# EAGLE design SenseTemp - CREAES (EAGLE 9.2.2)
LICENSE: CERN OHL v1.2; REV: CREAES; TITLE: SenseTemp; URL: https://github.com/CapableRobot/SenseTemp

## Sheet 1 of 3
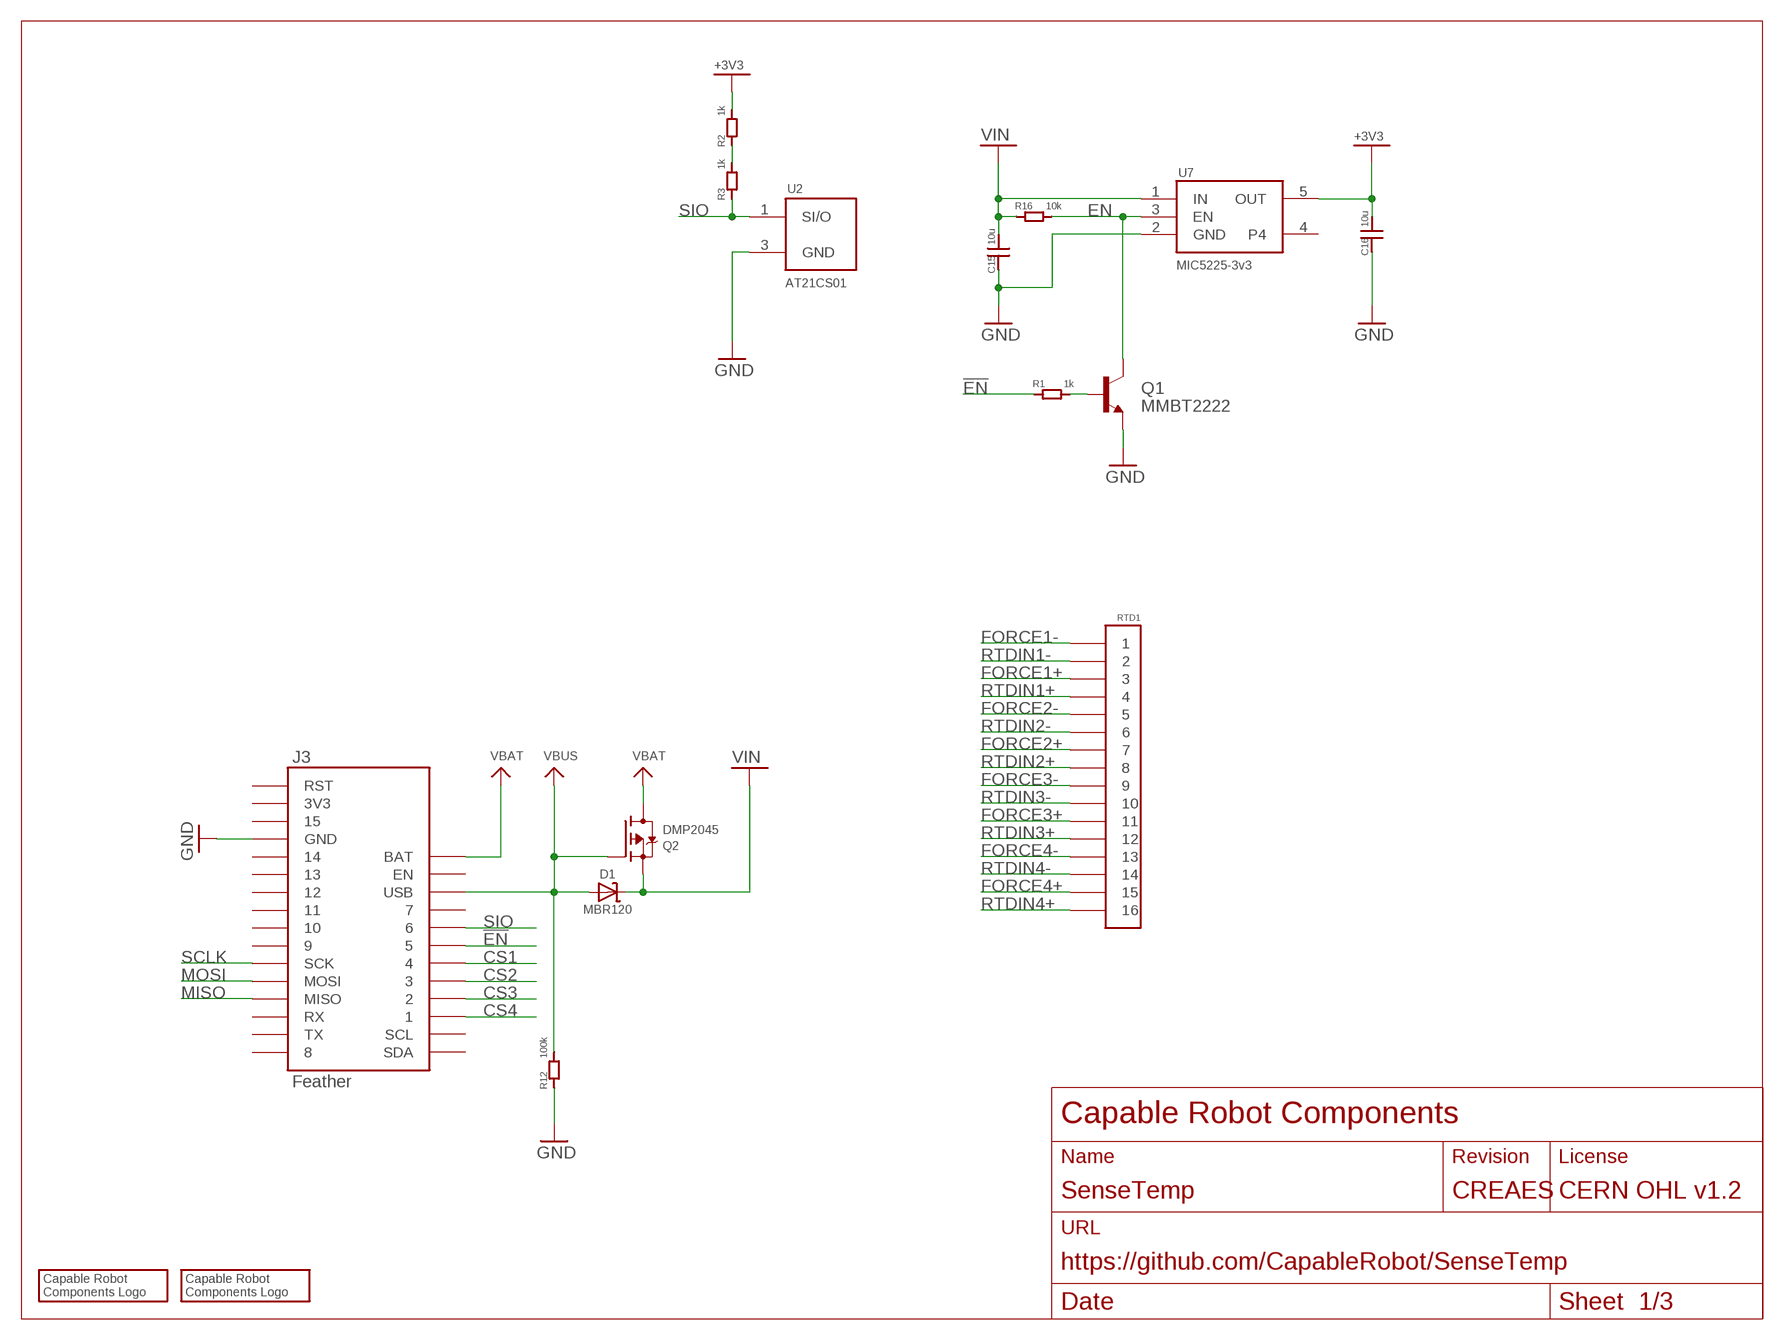
[diagram p0: schematic, sheet 1]

### Parts
C15  10u  CAP0805  [0805]
C16  10u  CAP0805  [0805]
D1  MBR120  DIODE-SCHOTTKYSOD-123  [SOD-123]
J3  FEATHERPTH  [FEATHER-PTH]
LOGO1  CRC-LOGO7SILK  [CRC-LOGO-7-SILK]
LOGO2  CRC-LOGO5  [CRC-LOGO-5]
Q1  MMBT2222  TRANSISTOR_NPNSOT23-3  [SOT23-3]
Q2  DMP2045  MOSFET-P  [SOT23-R]
R1  1k  RES0603  [0603]
R2  1k  RES0603  [0603]
R3  1k  RES0603  [0603]
R12  100k  RES0603  [0603]
R16  10k  RES0603  [0603]
RTD1  CONN-16ZT  [CONN-2X8-050-SMT-ZT]
U2  AT21CS01  [SOT23]
U7  3v3  MIC5225  [SOT25]

### Nets
!EN: J3.5 R1.1
+3V3: C16.2 R2.2 U7.5(OUT) ; also sheet 2,3
CS1: J3.4 ; also sheet 2
CS2: J3.3 ; also sheet 2
CS3: J3.2 ; also sheet 3
CS4: J3.1 ; also sheet 3
EN: Q1.3(C) R16.2 U7.3(EN)
FORCE1+: RTD1.3 ; also sheet 2
FORCE1-: RTD1.1 ; also sheet 2
FORCE2+: RTD1.7 ; also sheet 2
FORCE2-: RTD1.5 ; also sheet 2
FORCE3+: RTD1.11 ; also sheet 3
FORCE3-: RTD1.9 ; also sheet 3
FORCE4+: RTD1.15 ; also sheet 3
FORCE4-: RTD1.13 ; also sheet 3
GND: C15.1 C16.1 J3.GND Q1.2(E) R12.1 U2.3(GND) U7.2(GND) ; also sheet 2,3
MISO: J3.MISO ; also sheet 2,3
MOSI: J3.MOSI ; also sheet 2,3
N$4: R2.1 R3.2
N$17: Q1.1(B) R1.2
RTDIN1+: RTD1.4 ; also sheet 2
RTDIN1-: RTD1.2 ; also sheet 2
RTDIN2+: RTD1.8 ; also sheet 2
RTDIN2-: RTD1.6 ; also sheet 2
RTDIN3+: RTD1.12 ; also sheet 3
RTDIN3-: RTD1.10 ; also sheet 3
RTDIN4+: RTD1.16 ; also sheet 3
RTDIN4-: RTD1.14 ; also sheet 3
SCLK: J3.SCK ; also sheet 2,3
SIO: J3.6 R3.1 U2.1(SI/O)
VBAT: J3.BAT Q2.3(D)
VBUS: D1.A J3.USB Q2.1(G) R12.2
VIN: C15.2 D1.C Q2.2(S) R16.1 U7.1(IN)
Unconnected: J3.3V3 J3.7 J3.8 J3.9 J3.10 J3.11 J3.12 J3.13 J3.14 J3.15 J3.EN J3.RST J3.RX J3.SCL J3.SDA J3.TX U7.4

## Sheet 2 of 3
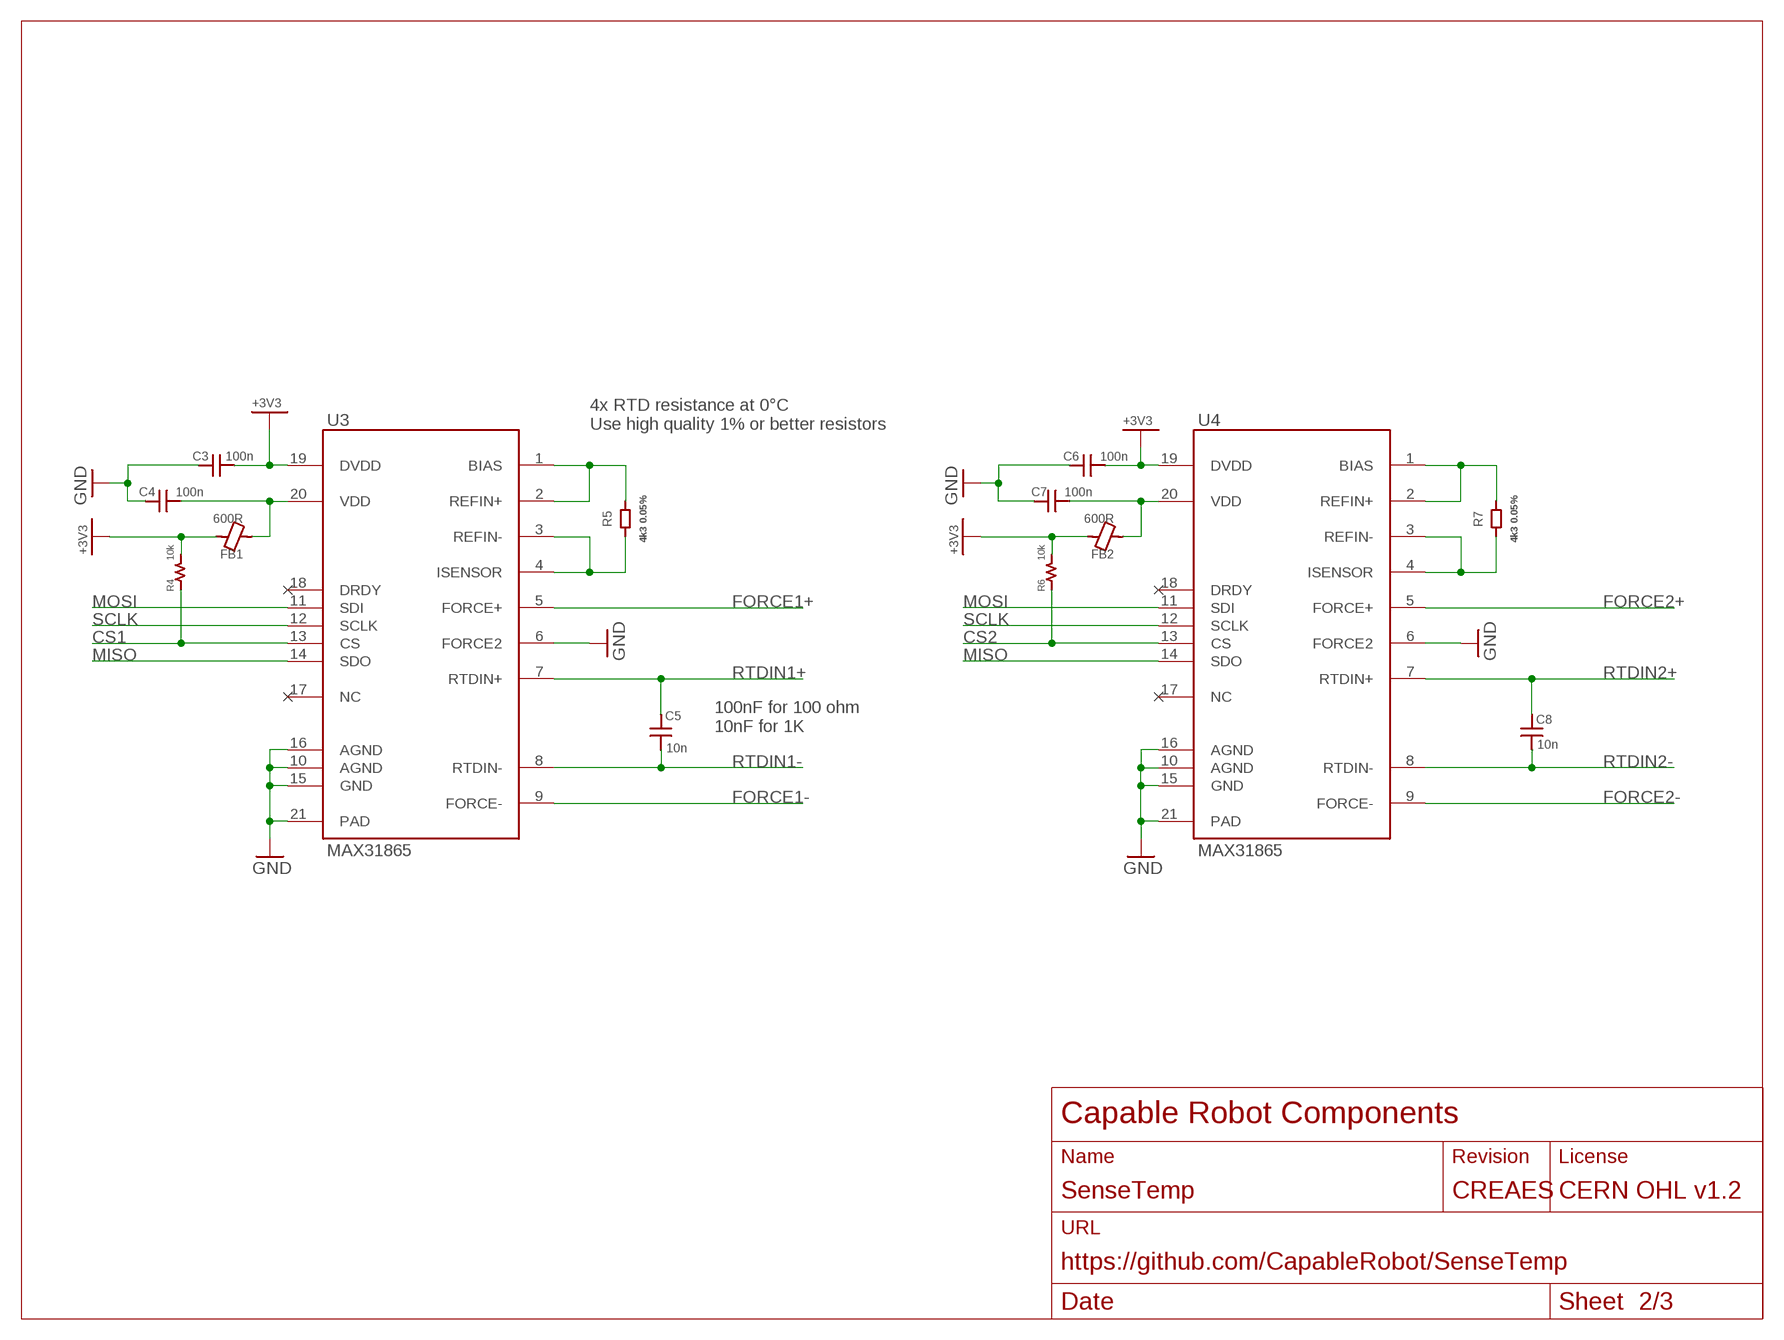
[diagram p1: schematic, sheet 2]

### Parts
C3  100n  CAP0603  [0603]
C4  100n  CAP0603  [0603]
C5  10n  CAP0603  [0603]
C6  100n  CAP0603  [0603]
C7  100n  CAP0603  [0603]
C8  10n  CAP0603  [0603]
FB1  600R  FER0603  [0603]
FB2  600R  FER0603  [0603]
R4  10k  RES0603  [0603]
R5  4k3 0.05%  RES0603  [0603]
R6  10k  RES0603  [0603]
R7  4k3 0.05%  RES0603  [0603]
U3  MAX31865  [QFN65P500X500X100-21T325]
U4  MAX31865  [QFN65P500X500X100-21T325]

### Nets
+3V3: C3.1 C6.1 FB1.2 FB2.2 R4.2 R6.2 U3.19(DVDD) U4.19(DVDD) ; also sheet 1,3
CS1: R4.1 U3.13(CS) ; also sheet 1
CS2: R6.1 U4.13(CS) ; also sheet 1
FORCE1+: U3.5(FORCE+) ; also sheet 1
FORCE1-: U3.9(FORCE-) ; also sheet 1
FORCE2+: U4.5(FORCE+) ; also sheet 1
FORCE2-: U4.9(FORCE-) ; also sheet 1
GND: C3.2 C4.2 C6.2 C7.2 U3.6(FORCE2) U3.10(AGND) U3.15(GND) U3.16(AGND) U3.21(PAD) U4.6(FORCE2) U4.10(AGND) U4.15(GND) U4.16(AGND) U4.21(PAD) ; also sheet 1,3
MISO: U3.14(SDO) U4.14(SDO) ; also sheet 1,3
MOSI: U3.11(SDI) U4.11(SDI) ; also sheet 1,3
N$5: R5.2 U3.1(BIAS) U3.2(REFIN+)
N$6: R5.1 U3.3(REFIN-) U3.4(ISENSOR)
N$7: C4.1 FB1.1 U3.20(VDD)
N$8: R7.2 U4.1(BIAS) U4.2(REFIN+)
N$9: R7.1 U4.3(REFIN-) U4.4(ISENSOR)
N$10: C7.1 FB2.1 U4.20(VDD)
RTDIN1+: C5.1 U3.7(RTDIN+) ; also sheet 1
RTDIN1-: C5.2 U3.8(RTDIN-) ; also sheet 1
RTDIN2+: C8.1 U4.7(RTDIN+) ; also sheet 1
RTDIN2-: C8.2 U4.8(RTDIN-) ; also sheet 1
SCLK: U3.12(SCLK) U4.12(SCLK) ; also sheet 1,3
Unconnected: U3.17(NC) U3.18(DRDY) U4.17(NC) U4.18(DRDY)

### Notes on the sheet
- 4x RTD resistance at 0°C 
  Use high quality 1% or better resistors
- 100nF for 100 ohm
  10nF for 1K

## Sheet 3 of 3
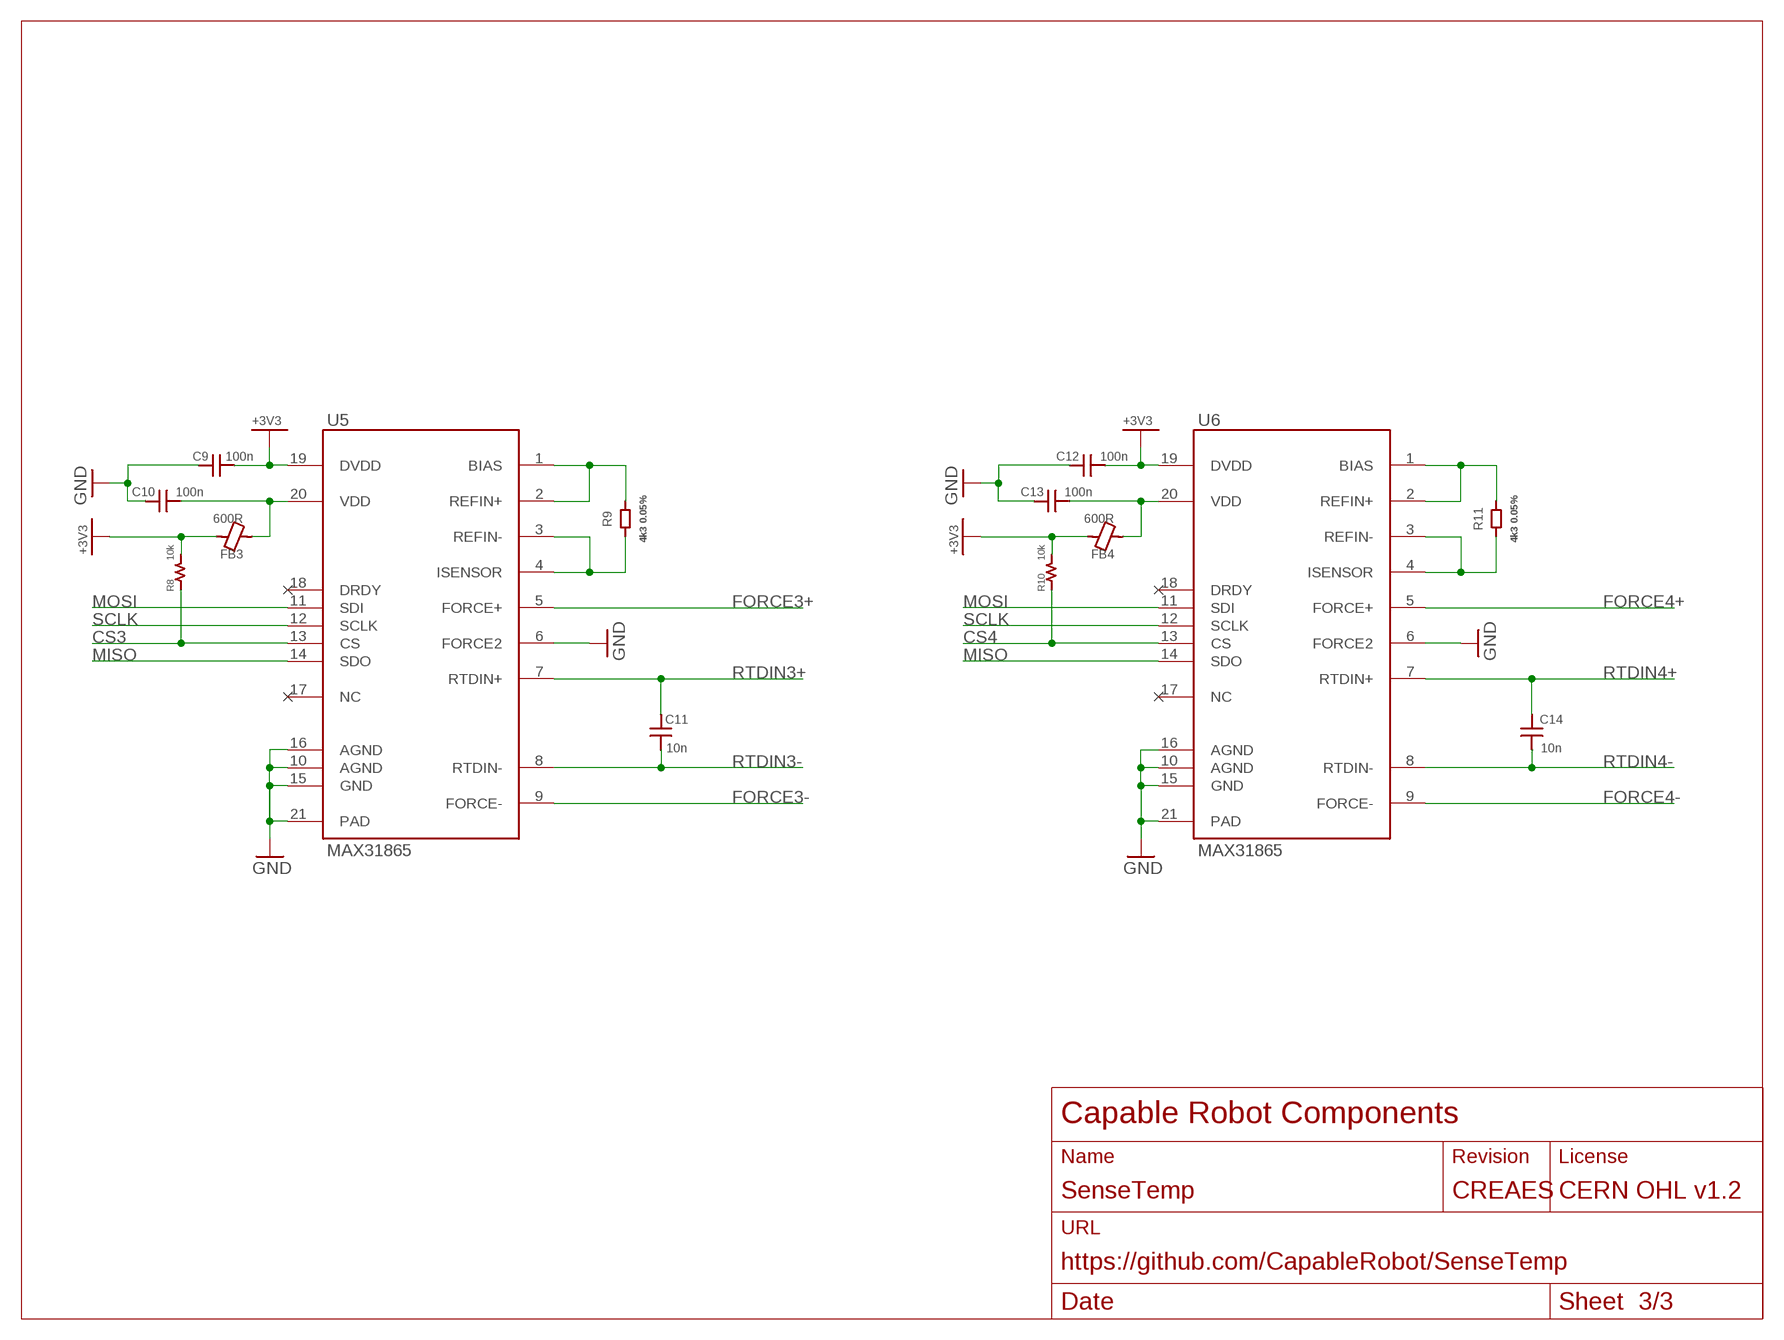
[diagram p2: schematic, sheet 3]

### Parts
C9  100n  CAP0603  [0603]
C10  100n  CAP0603  [0603]
C11  10n  CAP0603  [0603]
C12  100n  CAP0603  [0603]
C13  100n  CAP0603  [0603]
C14  10n  CAP0603  [0603]
FB3  600R  FER0603  [0603]
FB4  600R  FER0603  [0603]
R8  10k  RES0603  [0603]
R9  4k3 0.05%  RES0603  [0603]
R10  10k  RES0603  [0603]
R11  4k3 0.05%  RES0603  [0603]
U5  MAX31865  [QFN65P500X500X100-21T325]
U6  MAX31865  [QFN65P500X500X100-21T325]

### Nets
+3V3: C9.1 C12.1 FB3.2 FB4.2 R8.2 R10.2 U5.19(DVDD) U6.19(DVDD) ; also sheet 1,2
CS3: R8.1 U5.13(CS) ; also sheet 1
CS4: R10.1 U6.13(CS) ; also sheet 1
FORCE3+: U5.5(FORCE+) ; also sheet 1
FORCE3-: U5.9(FORCE-) ; also sheet 1
FORCE4+: U6.5(FORCE+) ; also sheet 1
FORCE4-: U6.9(FORCE-) ; also sheet 1
GND: C9.2 C10.2 C12.2 C13.2 U5.6(FORCE2) U5.10(AGND) U5.15(GND) U5.16(AGND) U5.21(PAD) U6.6(FORCE2) U6.10(AGND) U6.15(GND) U6.16(AGND) U6.21(PAD) ; also sheet 1,2
MISO: U5.14(SDO) U6.14(SDO) ; also sheet 1,2
MOSI: U5.11(SDI) U6.11(SDI) ; also sheet 1,2
N$11: R9.2 U5.1(BIAS) U5.2(REFIN+)
N$12: R9.1 U5.3(REFIN-) U5.4(ISENSOR)
N$13: C10.1 FB3.1 U5.20(VDD)
N$14: R11.2 U6.1(BIAS) U6.2(REFIN+)
N$15: R11.1 U6.3(REFIN-) U6.4(ISENSOR)
N$16: C13.1 FB4.1 U6.20(VDD)
RTDIN3+: C11.1 U5.7(RTDIN+) ; also sheet 1
RTDIN3-: C11.2 U5.8(RTDIN-) ; also sheet 1
RTDIN4+: C14.1 U6.7(RTDIN+) ; also sheet 1
RTDIN4-: C14.2 U6.8(RTDIN-) ; also sheet 1
SCLK: U5.12(SCLK) U6.12(SCLK) ; also sheet 1,2
Unconnected: U5.17(NC) U5.18(DRDY) U6.17(NC) U6.18(DRDY)

## Library data of the parts
C3-C16 = CapableRobot:CAP
D1 = Adafruit Feather M0 Express:DIODE-SCHOTTKY; MPN: MBR120VLSFT3G
FB1-FB4 = CapableRobot:FER: Ferrite
J3 = CapableRobot:FEATHER
LOGO1 LOGO2 = CapableRobot:CRC-LOGO
Q1 = Adafruit HUZZAH32 ESP32 Feather:TRANSISTOR_NPN: Transistor NPN BJT configuration in SOT23 package. MMBT2222 is the common NPN we use. Double check BCE configuration again layout.; MPN: MMBT2222LT1G
Q2 = Adafruit Feather M4 Express:MOSFET-P: P-Channel Mosfet LEGEND VDS: Voltage Drain-Source ID: Drain Current RDS(ON): Drain-Source On-State Resistance VGS(TH): Gate-Source Threshold Voltage CISS: Drain-Source Input Capacitance SOT-23 Name VDS ID RDS(ON) VGS(TH) CISS Order Number IRLML5103 30V 760mA 600 mOhm -- 75pF @ 25V Digikey: IRLML5103PBFCT-ND IRLML6401 12V 4.3A 50 mOhm 950mV @ 250µA 830pF @ 10V Digikey: IRLML6401PBFTR-ND NTR0202PL 20V 400mA 800 mOhm 2.3V @ 250uA 70pF @ 5V Digikey: NTR0202PLT1GOSTR-ND NTR4101PT1G 20V 1.8A 85 mOhm 1.2V @ 250uA 675pF @ 10V Digikey: NTR4101PT1GOSCT-ND DMP2004K 20V 600mA 900 mOhm 1V @ 250uA 175pF @ 16V Digikey: DMP2004KDICT-ND PMV65XP 20V 3.9A 76 mOhm 950mV @ 1mA 725pF @ 20V Digikey: 568-2358-2-ND TO-252 Name VDS ID RDS(ON) VGS(TH) CISS Order Number AOD417 30V 25A 34 mOhm 3V @ 250µA 920pF @ 15V Digikey: 785-1106-2-ND PowerPak Name VDS ID RDS(ON) VGS(TH) CISS Order Number AON7401 30V 12A 14 mOhm 3V @ 250µA 2600pF @ 15V Digikey: 785-1302-1-ND; MPN: DMP2045U-7
R1-R12 R16 = CapableRobot:RES
RTD1 = CapableRobot:CONN-16; MPN: 3221-16-0300-00
U2 = CapableRobot:AT21CS01: Single-Wire, I/O Powered 1-Kbit (128 x 8) Serial EEPROM with a Unique, Factory-Programmed 64-Bit Serial Number
U3-U6 = CapableRobot:MAX31865: RTD-to-Digital Converter
U7 = CapableRobot:MIC5225: Ultra-Low Quiescent Current 150mA Low Dropout Regulator

## Board
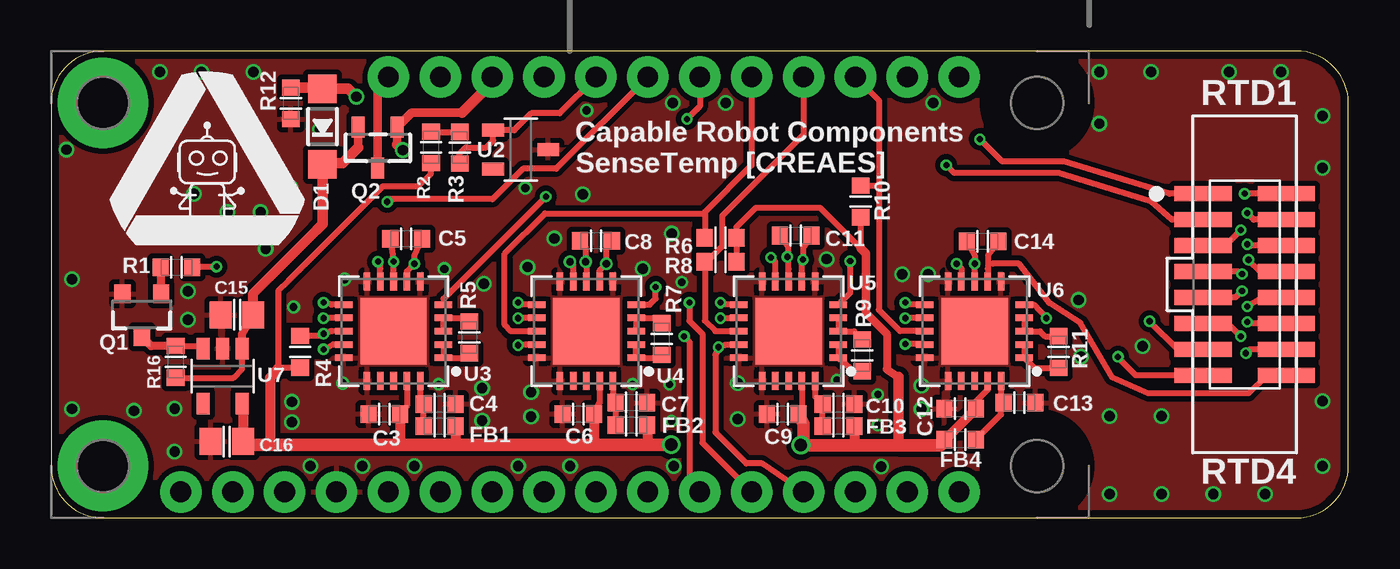
[diagram p3: board, top side]
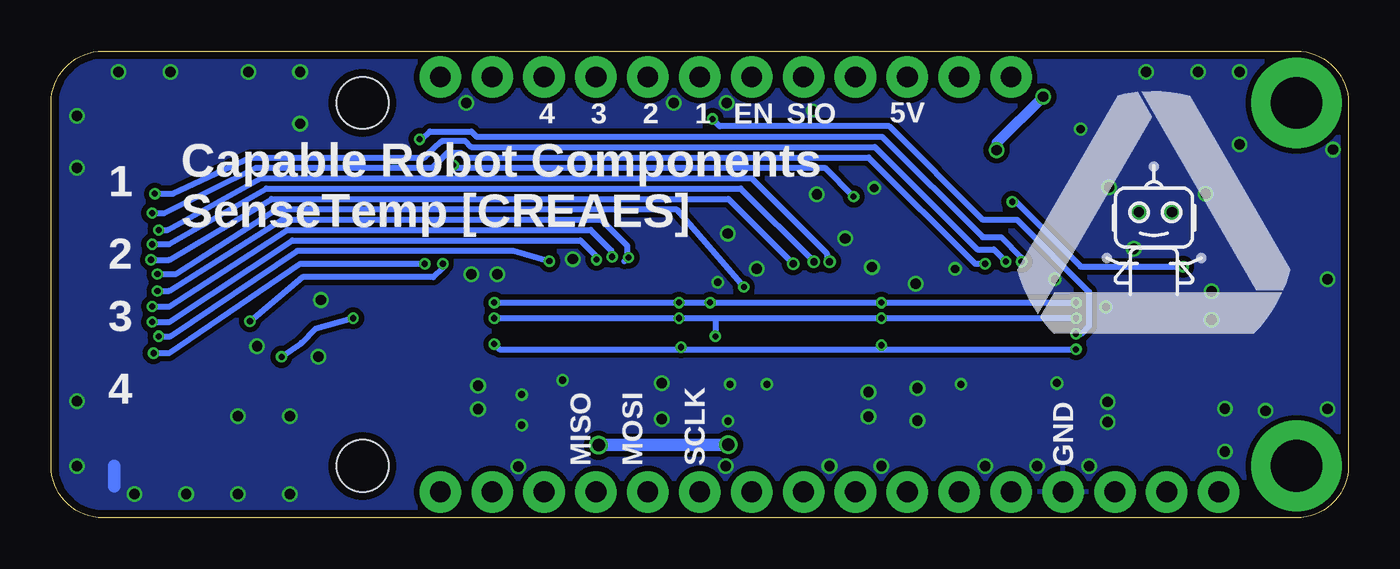
[diagram p4: board, bottom side, seen from below]

Size 63.5 x 22.86 mm. Coordinates in mm from the lower left corner, seen from the top.
Outline: 0,20.32 0,2.54 arc90 2.54,0 60.96,0 arc90 63.5,2.54 63.5,20.32 arc90 60.96,22.86 2.54,22.86 arc90 0,20.32
Copper layers (1*16): Top 0.035559375mm / dielectric 1.6mm / Bottom 0.035559375mm
Design rules "oshpark-2layer-tented *": minimum track width 6mil, minimum drill 10mil, track to track 6mil, track to pad 6mil, pad to pad 6mil, via to via 6mil, smd to smd 6mil, copper to edge 15mil, drill to drill 6mil, minimum pad ring 5mil, minimum via ring 5mil, stop-mask expansion 2.5mil, vias tented up to drill 25mil, thermal gap 10mil
Holes 2.54 mm at 48.26,2.54 48.26,20.32
tRestrict: area 45.7,17.8 to 50.8,22.9; area 45.7,0 to 50.8,5.1

### Footprints (pad centres in the part's own frame; a part is rotated, then mirrored left to right if it is on the bottom)
0603 = smd 0.79 x 0.86: 1 -0.775,0; 2 0.775,0
0805 = smd 1.079 x 1.321: 1 -0.794,0; 2 0.794,0
SOD-123 = smd 1.4 x 1.4: A 1.85,0; C -1.85,0
FEATHER-PTH = drill 1.016 pad 2.032: 1 39.37,21.59; 2 36.83,21.59; 3 34.29,21.59; 3V3 8.89,1.27; 4 31.75,21.59; 5 29.21,21.59; 6 26.67,21.59; 7 24.13,21.59; 8 44.45,1.27; 9 29.21,1.27; 10 26.67,1.27; 11 24.13,1.27; 12 21.59,1.27; 13 19.05,1.27; 14 16.51,1.27; 15 11.43,1.27; BAT 16.51,21.59; EN 19.05,21.59; GND 13.97,1.27; MISO 36.83,1.27; MOSI 34.29,1.27; RST 6.35,1.27; RX 39.37,1.27; SCK 31.75,1.27; SCL 41.91,21.59; SDA 44.45,21.59; TX 41.91,1.27; USB 21.59,21.59
SOT23-3 = smd 0.8 x 0.9: 1 -0.95,-1; 2 0.95,-1; 3 0,1.1
SOT23-R = smd 0.635 x 1.016: 1 -0.95,-1; 2 0.95,-1; 3 0,1
CONN-2X8-050-SMT-ZT = smd 0.737 x 2.794: 1 4.445,2.032; 2 4.445,-2.032; 3 3.175,2.032; 4 3.175,-2.032; 5 1.905,2.032; 6 1.905,-2.032; 7 0.635,2.032; 8 0.635,-2.032; 9 -0.635,2.032; 10 -0.635,-2.032; 11 -1.905,2.032; 12 -1.905,-2.032; 13 -3.175,2.032; 14 -3.175,-2.032; 15 -4.445,2.032; 16 -4.445,-2.032
SOT23 = smd 0.635 x 1.067: 1 0.95,1.346; 2 -0.95,1.346; 3 0,-1.346
QFN65P500X500X100-21T325 = smd 0.86 x 0.32: 1 -2.435,1.3; 2 -2.435,0.65; 3 -2.435,0; 4 -2.435,-0.65; 5 -2.435,-1.3; 11 2.435,-1.3; 12 2.435,-0.65; 13 2.435,0; 14 2.435,0.65; 15 2.435,1.3 | smd 0.32 x 0.86: 6 -1.3,-2.435; 7 -0.65,-2.435; 8 0,-2.435; 9 0.65,-2.435; 10 1.3,-2.435; 16 1.3,2.435; 17 0.65,2.435; 18 0,2.435; 19 -0.65,2.435; 20 -1.3,2.435 | smd 3.25 x 3.25: 21 0,0
SOT25 = smd 0.635 x 1.067: 1 -0.95,-1.346; 2 0,-1.346; 3 0.95,-1.346; 4 0.95,1.346; 5 -0.95,1.346

### Placement (x,y rotation side)
C3  16.31,5.08 180 top
C4  19.02,5.57 0 top
C5  17.38,13.67 180 top
C6  25.81,5.08 180 top
C7  28.4,5.64 0 top
C8  26.67,13.57 180 top
C9  35.81,5.08 180 top
C10  38.54,5.57 0 top
C11  36.45,13.82 180 top
C12  44.5,5.34 180 top
C13  47.4,5.64 0 top
C14  45.59,13.54 180 top
C15  9.1,9.94 0 top
C16  8.6,3.74 0 top
D1  13.29,19.16 90 top
FB1  19.02,4.5 0 top
FB2  28.4,4.54 0 top
FB3  38.54,4.5 0 top
FB4  44.5,3.84 180 top
J3  0,0 0 top
LOGO1  9.52,13.96 0 bottom
LOGO2  7.65,16.89 0 top
Q1  4.44,9.97 180 top
Q2  15.99,18.13 180 top
R1  6.14,12.28 180 top
R2  18.6,18.14 270 top
R3  20,18.12 90 top
R4  12.19,8.13 270 top
R5  20.47,8.84 270 top
R6  32.77,13.72 0 top
R7  29.9,8.76 270 top
R8  32.77,12.54 0 top
R9  39.7,7.96 270 top
R10  39.62,15.49 270 top
R11  49.32,8.12 270 top
R12  11.74,20.3 90 top
R16  6.1,7.64 90 top
RTD1  58.42,11.43 90 top
U2  22.99,18.03 90 top
U3  16.77,9.14 180 top
U4  26.2,9.14 180 top
U5  36.1,9.14 180 top
U6  45.2,9.14 180 top
U7  8.4,6.94 180 top

### Tracks (layer width: path | path; a pad name or v marks a point on that pad's centre or on a via)
!EN  (via drill 0.3)
  Top 0.3: J3.5 24.72,17.1 23.1,17.1 21.6,15.6 16.57,15.6 v16.45,15.48 | v8.1,12.3 8.08,12.28 R1.1
  Bottom 0.3: v16.45,15.48 16.28,15.48 13.1,12.3 v8.1,12.3
+3V3  (via drill 0.61)
  Top 0.3: U3.19 17.41,5.49 C3.1 | U4.19 26.85,5.65 C6.1 | U5.19 36.75,5.16 C9.1 | 15.94,15.94 16.24,16.24 18,16.24 18.6,16.84 R2.2 | 11.61,11.61 11.12,11.12 11.12,7.35 | U6.19 45.85,6.29 45.27,5.71 45.27,5.29 | 26.58,3.6 26.6,3.58 | 34.5,15.19 37.64,15.19 38.61,14.22
  Top 0.305: C6.1 26.81,5.13 | C3.1 17.11,5.13 | 12.05,7.21 R4.2 11.12,7.35 | R6.2 33.49,13.77 | 38.61,14.22 39.62,13.21 R10.2 | 36.72,5.13 C9.1 36.57,5.07 | R6.2 R8.2 | R6.2 33.54,14.21 33.53,14.22 34.5,15.19 | 15.94,15.94 11.61,11.61
  Top 0.4: 41.48,6.9 40.9,7.28 40.9,9.01 39.88,10.03
  Top 0.406: 39.88,10.03 39.88,12.95 39.62,13.21
  Top 0.5: 11.12,7.35 10.72,6.85 10.72,3.58 | U7.5 9.39,5.55 C16.2 9.45,3.68 | 43.54,3.56 43.54,3.65 FB4.2 43.76,3.82 C12.1 45.27,5.29 | FB3.2 39.32,3.54 40.4,3.56 | C6.1 26.58,3.6 | FB2.2 29.2,4.51 29.2,3.58 | FB1.2 19.79,3.59 19.8,3.58 | C3.1 17.09,3.6 17.1,3.58
  Top 0.508: 41.48,6.9 41.48,3.56
  Top 0.6: 9.4,3.58 9.45,3.68
  Top 0.61: v30.35,3.58 29.2,3.58 26.6,3.58 19.8,3.58 17.1,3.58 10.72,3.58 9.4,3.58 | 36.84,3.56 v36.7,3.56 36.76,3.62 | 36.84,3.56 40.4,3.56 41.48,3.56 43.54,3.56 | C9.1 36.84,4.61 36.84,3.56
  Bottom 0.61: v30.35,3.58 36.58,3.58 v36.7,3.56
CS1  (via drill 0.3)
  Top 0.3: U3.13 14.27,9.14 13.76,9.14
  Top 0.305: 13.76,9.14 v13.34,9.02 13.22,8.9 R4.1 | v31.13,19.53 31.75,20.16 J3.4
  Bottom 0.305: v13.34,9.02 13.08,9.02 12.7,9.4 12.7,11.07 16.21,14.59 17.89,14.59 22.48,19.18 30.77,19.18 v31.13,19.53
CS2
  Top 0.3: U4.13 22.5,9.14 22.2,9.44 22.2,12.94 24.17,14.91 31.93,14.91 32,14.99
  Top 0.305: 31.99,13.96 R6.1 32,13.73 32,14.99 34.29,17.27 J3.3
CS3
  Top 0.3: 32.51,9.14 U5.13
  Top 0.305: 32.51,9.14 32,9.65 32,12.45 | 32,12.45 32,12.55 R8.1 | J3.2 36.83,18.77 32.84,14.78 32.84,13.28 32,12.45
CS4
  Top 0.3: U6.13 41.56,9.14
  Top 0.305: 40.51,16.26 40.51,10.19 41.56,9.14 | R10.1 39.64,16.26 40.51,16.26 | J3.1 40.51,20.45 40.51,16.26
EN
  Top 0.3: R16.2 7.32,8.41 U7.3
  Top 0.4: R16.2 4.89,8.41 Q1.3
FORCE1+  (via drill 0.3)
  Top 0.3: 19.2,10.72 U3.5
  Top 0.305: v24.22,15.74 19.2,10.72 | v43.81,17.27 44.2,16.89 49.34,16.89 53.85,15.49 54.86,14.61 RTD1.3
  Bottom 0.305: v24.22,15.74 25.63,17.14 43.69,17.14 v43.81,17.27
FORCE1-  (via drill 0.3)
  Top 0.3: U3.9 16.11,12.21 16.11,12.41
  Top 0.305: 16.11,12.41 v16,12.55 | RTD1.1 54.74,15.88 49.59,17.45 46.56,17.45 v45.47,18.54
  Bottom 0.305: v16,12.55 16,12.75 17,13.74 17.9,13.74 22.82,18.67 42.67,18.67 42.93,18.92 44.96,18.92 45.34,18.54 v45.47,18.54
FORCE2+  (via drill 0.3)
  Top 0.3: U4.5 29.3,10.44 29.59,10.73 v29.59,11.3
  Top 0.305: v58.29,11.94 58.1,12.06 RTD1.7
  Bottom 0.305: v29.59,11.3 32.89,15.11 52.45,15.11 57.4,11.94 v58.29,11.94
FORCE2-  (via drill 0.3, 0.36)
  Top 0.3: v25.4,12.55 25.55,12.4 U4.9
  Top 0.305: 25.51,12.43 v25.4,12.55 | RTD1.5 57.47,13.34 v58.23,14.1
  Bottom 0.305: v25.4,12.55 25.53,12.67 25.53,12.95 29.21,16.64 53.21,16.64 57.78,14.1 v58.23,14.1
FORCE3+  (via drill 0.3)
  Top 0.3: U5.5 39.12,11.02 v39.12,12.57
  Top 0.305: v58.23,8.89 57.59,9.53 RTD1.11
  Bottom 0.305: v39.12,12.57 40.89,13.08 51.44,13.08 57.66,8.89 v58.23,8.89
FORCE3-  (via drill 0.3)
  Top 0.3: U5.9 35.45,12.53 v35.23,12.75
  Top 0.305: v58.29,11.11 57.98,10.79 RTD1.9
  Bottom 0.305: v35.23,12.75 35.43,12.57 35.31,12.7 35.31,13.34 36.58,14.61 52.2,14.61 57.72,11.11 v58.29,11.11
FORCE4+  (via drill 0.3)
  Top 0.305: v48.71,9.78 48.1,10.44 U6.5 | RTD1.15 53.09,6.99 52.22,7.85 v52.22,7.88
  Bottom 0.305: v48.71,9.78 50.55,9.27 51.24,8.57 52.23,7.89 v52.22,7.88
FORCE4-  (via drill 0.3)
  Top 0.3: 44.56,12.21 44.55,12.2 U6.9
  Top 0.305: v44.32,12.45 44.56,12.21 | v53.77,9.63 55.14,8.26 RTD1.13
  Bottom 0.305: v44.32,12.45 44.32,12.25 44.78,11.78 51.18,11.78 v53.77,9.63
GND  (via drill 0.35, 0.38, 0.4, 0.51)
  Top 0.305: C6.2 24.86,5.18 | C12.2 43.91,5.18
  Bottom 0.6: 60.4,2.54 60.4,1.54
  other vias: 10.26,14.98 8.64,14.98 10.5,13.18 6.7,11.1 4.05,5.24 11.79,5.68 14.27,6.6 12.7,2.54 15.24,2.54 17.78,2.54 22.86,2.54 25.4,2.54 33.6,6.6 41.66,11.94 42.93,11.94 43.18,20.32 57.66,21.84 7.37,21.84 5.33,18.29 0.76,18.03 1.02,11.68 1.02,5.33 23.5,4.95 30.48,2.54 33.6,4.83 42.6,5.33 37.97,12.67 30.38,13.92 28.96,12.19 26.02,15.85 23.21,16.16 19.25,12.19 21.19,11.46 14.37,11.68 23.32,12.28 11.71,16.18 5.33,21.84 33.02,20.32 11.86,10.33 6.99,15.88 53.42,8.4 50.29,10.67 40.47,4.54 42.6,6.48 38.47,6.74 30.37,4.74 28.47,6.54 30.27,6.54 23.5,6.15 21.09,4.75 21.09,6.35 18.97,6.54 24.62,13.68 40.47,6.04 30.87,11.54 50.42,7.9 6.7,9.7 6.05,3.24 6.05,5.34 11.79,4.68 30.42,20.32 40.63,2.52 62.23,5.71 51.81,1.16 13.11,19.03 26.21,19.96 51.31,21.84 53.85,21.84 51.31,19.3 54.35,1.16 56.89,1.16 59.43,1.16 62.23,2.54 51.81,4.97 54.35,4.97 62.23,19.68 62.23,17.14 60.2,21.84 9.91,21.84
  pour Bottom (isolate 0.254, rank 6): 0,0 63.5,0 63.5,25.4 0,25.4
  pour Top (isolate 0.254): 0,22.86 0,0 12.7,0 48,0.14 48.19,0 63.5,0 63.5,22.86
MISO  (via drill 0.3)
  Top 0.3: U3.14 13.83,8.49 | U4.14 23.23,8.49 | v32.67,8.36 33,8.49 U5.14 | U6.14 42.75,8.51 v41.81,8.51
  Top 0.305: 13.83,8.49 v13.34,8.26 | J3.MISO 34.8,2.67 34.04,2.67 32.51,4.19 32.51,8 v32.67,8.36 | 23.23,8.49 v22.86,8.46
  Bottom 0.305: v41.81,8.51 41.56,8.26 32.8,8.24 v32.67,8.36 32.5,8.24 22.9,8.24 | 22.8,8.24 22.9,8.24 | 22.9,8.24 v22.86,8.46 22.8,8.24 | 22.8,8.24 v13.34,8.26
MOSI  (via drill 0.3)
  Top 0.3: U3.11 13.74,10.44 13.73,10.44 | U4.11 22.96,10.44 | U5.11 32.87,10.44 v32.77,10.54 | U6.11 41.91,10.44 v41.81,10.54
  Top 0.305: 13.73,10.44 v13.34,10.54 | 22.96,10.44 v22.86,10.54 | J3.MOSI 31.88,3.68 31.88,9.02 31.24,9.65 v31.24,10.54
  Bottom 0.305: v41.81,10.54 v32.77,10.54 v31.24,10.54 v22.86,10.54 v13.34,10.54
N$1  (via drill 2.54 pad 4.45)
  other vias: 2.54,2.54
N$2  (via drill 2.54 pad 4.45)
  other vias: 2.54,20.32
N$4
  Top 0.3: R2.1 18.61,18.9 R3.2
N$5
  Top 0.3: U3.2 U3.1 20.35,7.84 R5.2
  Top 0.305: 20.67,7.84 R5.2
N$6
  Top 0.3: U3.3 U3.4 20.2,9.79 R5.1
N$7
  Top 0.3: U3.20 18.07,5.75 C4.1 FB1.1
N$8
  Top 0.3: U4.1 U4.2 | 28.74,7.84 U4.1 | U4.1 29.76,7.84 R7.2
N$9
  Top 0.3: U4.3 U4.4 29.64,9.79 R7.1
N$10
  Top 0.3: U4.20 27.5,5.97 C7.1 FB2.1
N$11
  Top 0.3: U5.2 U5.1 39.29,7.18 R9.2
N$12
  Top 0.3: U5.4 U5.3 39.3,9.14 R9.1
N$13
  Top 0.3: FB3.1 C10.1 37.4,5.94 U5.20
N$14
  Top 0.3: U6.2 U6.1 48.13,7.34 R11.2
N$15
  Top 0.3: U6.4 U6.3 | U6.3 | U6.3 48.4,9.14 48.65,8.89 R11.1
N$16
  Top 0.3: U6.20 46.5,5.51 | 46.5,5.51 C13.1 | FB4.1 46.5,5.07 46.5,5.51
N$17
  Top 0.4: Q1.1 5.39,12.26 R1.2
RTDIN1+  (via drill 0.3)
  Top 0.3: U3.7 17.41,12.08
  Top 0.305: 17.41,12.08 v17.78,12.45 17.78,12.83 C5.1 | v58.55,14.92 58.86,14.61 RTD1.4
  Bottom 0.305: v17.78,12.45 18.28,12.45 23.49,17.65 43.21,17.65 43.44,17.88 44.09,17.88 44.83,17.14 53.47,17.14 57.98,14.92 v58.55,14.92
RTDIN1-  (via drill 0.3)
  Top 0.3: U3.8 v16.77,12.54 v16.76,12.55
  Top 0.305: C5.2 v16.76,12.55 | RTD1.2 v58.42,15.88
  Bottom 0.305: v16.76,12.55 17.36,13.15 18.16,13.15 23.18,18.16 42.94,18.16 43.25,18.47 44.35,18.47 44.4,18.41 45.09,17.78 45.21,17.65 53.72,17.65 57.53,15.88 v58.42,15.88
RTDIN2+  (via drill 0.3, 0.36)
  Top 0.3: U4.7 26.85,12.12 v27.18,12.45 27.18,13.46 C8.1
  Top 0.305: v58.61,12.64 59.18,12.06 RTD1.8
  Bottom 0.305: v27.18,12.45 30.35,15.62 52.7,15.62 57.72,12.64 v58.61,12.64
RTDIN2-  (via drill 0.3, 0.36)
  Top 0.3: v26.16,12.55 26.2,12.51 U4.8
  Top 0.305: C8.2 25.65,13.57 26.16,13.26 v26.16,12.55 | v58.55,13.4 58.74,13.34 RTD1.6
  Bottom 0.305: v26.16,12.55 29.75,16.13 52.96,16.13 57.72,13.4 v58.55,13.4
RTDIN3+  (via drill 0.3)
  Top 0.3: U5.7 36.75,12.59 v36.8,12.65 36.8,13.22
  Top 0.305: C11.1 36.8,13.22 | RTD1.12 58.67,9.53 v58.55,9.59
  Bottom 0.305: v36.8,12.65 36.8,12.8 37.59,13.59 51.69,13.59 57.72,9.59 v58.55,9.59
RTDIN3-  (via drill 0.3)
  Top 0.3: 36.07,12.75 v36.04,12.79 | U5.8 36.1,12.19 36.1,12.7 36.1,12.72 36.07,12.75 | 36.07,13.26 36.07,12.75
  Top 0.305: C11.2 36.07,13.26 | v58.55,10.35 59.31,10.79 RTD1.10
  Bottom 0.305: v36.04,12.79 36.09,13.1 37.08,14.1 51.94,14.1 57.72,10.35 v58.55,10.35
RTDIN4+
  Top 0.3: 45.86,12.41 45.85,12.2 U6.7
  Top 0.305: C14.1 45.86,12.86 45.86,12.41 46.1,12.45 47.37,12.45 48.87,10.51 50.38,9.53 51.94,6.88 53.7,6.1 58.61,6.1 59.5,6.99 RTD1.16
RTDIN4-  (via drill 0.3)
  Top 0.3: v45.21,12.45 45.2,12.43 U6.8
  Top 0.305: C14.2 45.21,12.85 v45.21,12.45 | v58.48,8.06 58.67,8.26 RTD1.14
  Bottom 0.305: v45.21,12.45 51.31,12.45 57.72,8.06 v58.48,8.06
SCLK  (via drill 0.3)
  Top 0.3: v32.77,9.78 v32.78,9.79 U5.12 | U6.12 v41.82,9.79 v41.81,9.78
  Top 0.305: v13.34,9.78 14.41,9.78 14.4,9.79 U3.12 | U4.12 v22.86,9.78 | J3.SCK 31.24,1.78 31.24,8.64 v30.99,8.89 | U4.12 | U4.12 23.81,9.78
  Bottom 0.305: v41.81,9.78 v32.77,9.78 30.99,9.78 | 30.99,9.78 v22.86,9.78 v13.34,9.78 | 30.99,9.78 v30.99,8.89
SIO
  Top 0.3: R3.1 20,17.84 20.3,18.14 21.3,18.14 21.64,18.48 U2.1
  Top 0.305: 21.4,18.98 U2.1 22.67,18.98 23.5,19.81 24.89,19.81 J3.6
VBAT
  Top 0.406: Q2.3 15.99,21.07
  Top 0.5: 15.99,21.07 J3.BAT
VBUS  (via drill 0.51)
  Top 0.406: 20.11,19.83 17.64,19.83 Q2.1 16.94,18.29
  Top 0.508: R12.2 13.23,21.07 D1.A 14.55,21.01 v14.94,20.62 | J3.USB 21.59,21.31 20.11,19.83 | v17.22,18.01 16.94,18.29
  Bottom 0.508: v14.94,20.62 17.2,18.36 17.2,18.03 v17.22,18.01
VIN
  Top 0.3: R16.1 8.93,6.87 9.35,7.29 U7.1
  Top 0.4: U7.1 9.35,9 C15.2
  Top 0.406: 15.04,18.14 Q2.2
  Top 0.5: C15.2 9.89,10.99 13.01,14.11
  Top 0.508: 13.01,14.11 13.29,14.39 D1.C 13.35,17.37 14.28,17.37 15.04,18.14

### Text on the board
tPlace: Capable Robot Components / SenseTemp [CREAES] | RTD4
bPlace: 5V | SIO | EN | 1 | 2 | 3 | 4 | 1 | Capable Robot Components / SenseTemp [CREAES] | 2 | 3 | 4 | GND | SCLK | MOSI | MISO